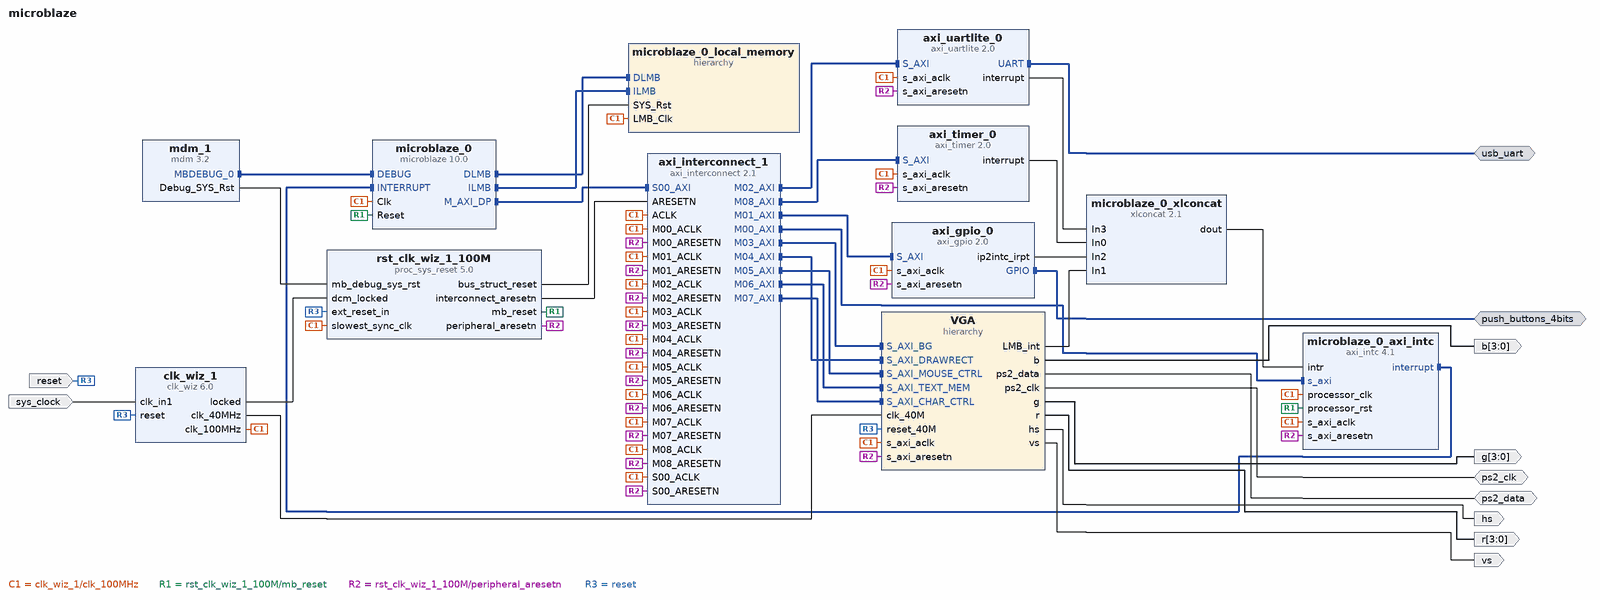
[diagram p0: block diagram of the top level]
# Vivado block design microblaze, xc7a35tcpg236-1, Vivado 2018.2
create_bd_design microblaze

create_bd_intf_port -mode Master -vlnv xilinx.com:interface:uart_rtl:1.0 usb_uart
create_bd_intf_port -mode Master -vlnv xilinx.com:interface:gpio_rtl:1.0 push_buttons_4bits
create_bd_port -dir I -type rst reset
set_property -dict {CONFIG.POLARITY ACTIVE_HIGH} [get_bd_ports reset]
create_bd_port -dir I -type clk sys_clock
set_property -dict {CONFIG.FREQ_HZ 100000000 CONFIG.PHASE 0.000} [get_bd_ports sys_clock]
create_bd_port -dir IO ps2_data
create_bd_port -dir IO ps2_clk
create_bd_port -dir O -from 3 -to 0 b
create_bd_port -dir O -from 3 -to 0 g
create_bd_port -dir O -from 3 -to 0 r
create_bd_port -dir O hs
create_bd_port -dir O vs

create_bd_cell -type ip -vlnv xilinx.com:ip:mdm:3.2 mdm_1
create_bd_cell -type ip -vlnv xilinx.com:ip:clk_wiz:6.0 clk_wiz_1
set_property -dict [list \
  CONFIG.ENABLE_CLOCK_MONITOR false \
  CONFIG.PRIMITIVE MMCM \
  CONFIG.CLKOUT2_USED true \
  CONFIG.NUM_OUT_CLKS 2 \
  CONFIG.CLK_OUT1_PORT clk_100MHz \
  CONFIG.CLK_OUT2_PORT clk_40MHz \
  CONFIG.CLKOUT2_REQUESTED_OUT_FREQ 40.000 \
  CONFIG.PRIM_SOURCE Single_ended_clock_capable_pin \
  CONFIG.MMCM_DIVCLK_DIVIDE 1 \
  CONFIG.MMCM_CLKOUT1_DIVIDE 25 \
  CONFIG.USE_BOARD_FLOW true \
  CONFIG.CLK_IN1_BOARD_INTERFACE sys_clock \
  CONFIG.RESET_BOARD_INTERFACE reset \
  CONFIG.CLKOUT2_JITTER 159.371 \
  CONFIG.CLKOUT2_PHASE_ERROR 98.575 \
] [get_bd_cells clk_wiz_1]
create_bd_cell -type ip -vlnv xilinx.com:ip:proc_sys_reset:5.0 rst_clk_wiz_1_100M
set_property -dict {CONFIG.USE_BOARD_FLOW true CONFIG.RESET_BOARD_INTERFACE reset} [get_bd_cells rst_clk_wiz_1_100M]
create_bd_cell -type ip -vlnv xilinx.com:ip:axi_uartlite:2.0 axi_uartlite_0
set_property -dict {CONFIG.USE_BOARD_FLOW true CONFIG.UARTLITE_BOARD_INTERFACE usb_uart} [get_bd_cells axi_uartlite_0]
create_bd_cell -type ip -vlnv xilinx.com:ip:xlconcat:2.1 microblaze_0_xlconcat
set_property -dict {CONFIG.NUM_PORTS 4} [get_bd_cells microblaze_0_xlconcat]
create_bd_cell -type ip -vlnv xilinx.com:ip:axi_intc:4.1 microblaze_0_axi_intc
set_property -dict {CONFIG.C_HAS_FAST 1} [get_bd_cells microblaze_0_axi_intc]
create_bd_cell -type ip -vlnv xilinx.com:ip:axi_timer:2.0 axi_timer_0
set_property -dict {CONFIG.mode_64bit 0 CONFIG.enable_timer2 0} [get_bd_cells axi_timer_0]
create_bd_cell -type ip -vlnv xilinx.com:ip:axi_gpio:2.0 axi_gpio_0
set_property -dict [list \
  CONFIG.C_INTERRUPT_PRESENT 1 \
  CONFIG.USE_BOARD_FLOW true \
  CONFIG.GPIO_BOARD_INTERFACE push_buttons_4bits \
] [get_bd_cells axi_gpio_0]
create_bd_cell -type hier VGA
create_bd_cell -type ip -vlnv xilinx.com:ip:axi_interconnect:2.1 axi_interconnect_1
set_property -dict {CONFIG.NUM_MI 9} [get_bd_cells axi_interconnect_1]
create_bd_cell -type ip -vlnv xilinx.com:ip:microblaze:10.0 microblaze_0
set_property -dict {CONFIG.C_D_AXI 1 CONFIG.C_D_LMB 1 CONFIG.C_I_LMB 1 CONFIG.C_DEBUG_ENABLED 1} [get_bd_cells microblaze_0]
create_bd_cell -type hier microblaze_0_local_memory

# ---- hierarchy /VGA ----
current_bd_instance /VGA
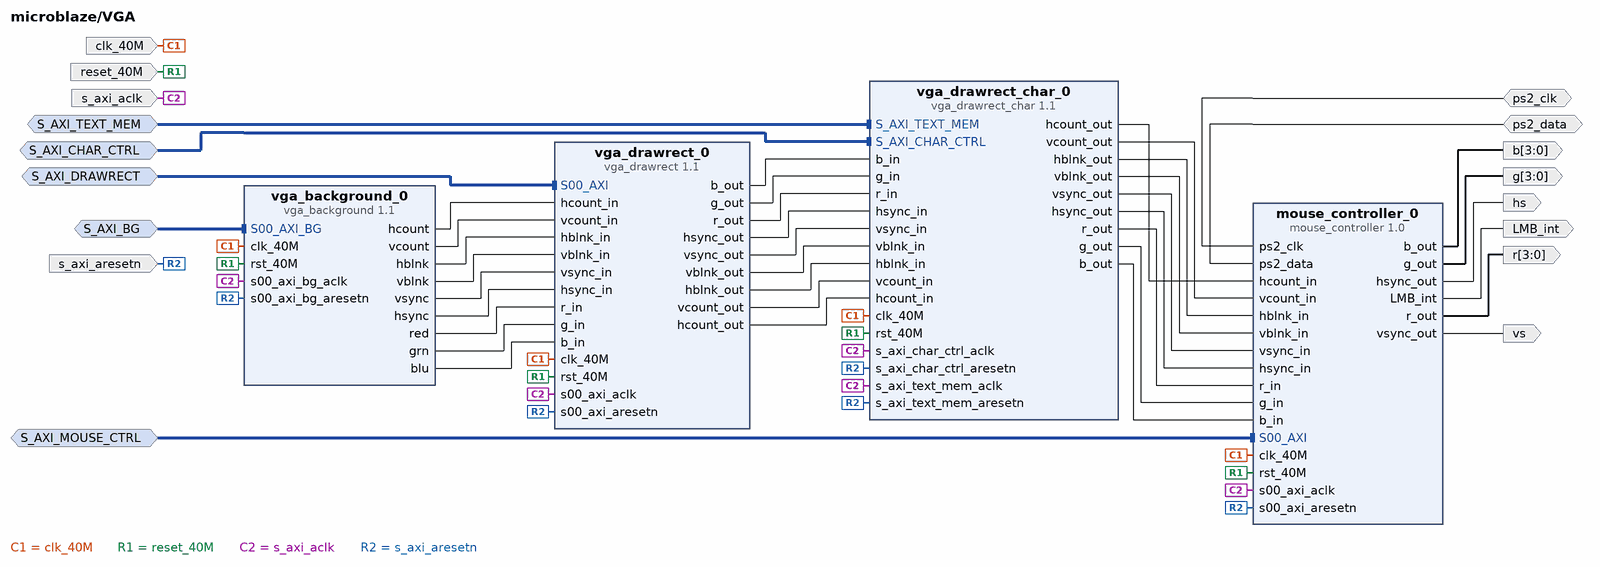
[diagram p1: block diagram inside /VGA]
create_bd_intf_pin -mode Slave -vlnv xilinx.com:interface:aximm_rtl:1.0 S_AXI_BG
create_bd_intf_pin -mode Slave -vlnv xilinx.com:interface:aximm_rtl:1.0 S_AXI_DRAWRECT
create_bd_intf_pin -mode Slave -vlnv xilinx.com:interface:aximm_rtl:1.0 S_AXI_MOUSE_CTRL
create_bd_intf_pin -mode Slave -vlnv xilinx.com:interface:aximm_rtl:1.0 S_AXI_TEXT_MEM
create_bd_intf_pin -mode Slave -vlnv xilinx.com:interface:aximm_rtl:1.0 S_AXI_CHAR_CTRL
create_bd_pin -dir I clk_40M
create_bd_pin -dir I reset_40M
create_bd_pin -dir I -type clk s_axi_aclk
create_bd_pin -dir I -type rst s_axi_aresetn
create_bd_pin -dir O vs
create_bd_pin -dir O hs
create_bd_pin -dir O -from 3 -to 0 r
create_bd_pin -dir O -from 3 -to 0 g
create_bd_pin -dir O -from 3 -to 0 b
create_bd_pin -dir IO ps2_clk
create_bd_pin -dir IO ps2_data
create_bd_pin -dir O LMB_int

create_bd_cell -type ip -vlnv xilinx.com:user:mouse_controller:1.0 mouse_controller_0
create_bd_cell -type ip -vlnv xilinx.com:user:vga_background:1.1 vga_background_0
create_bd_cell -type ip -vlnv xilinx.com:user:vga_drawrect_char:1.1 vga_drawrect_char_0
create_bd_cell -type ip -vlnv xilinx.com:user:vga_drawrect:1.1 vga_drawrect_0
set_property -dict {CONFIG.C_S00_AXI_ADDR_WIDTH 9 CONFIG.NUMBER_OF_RECTANGLES 64} [get_bd_cells vga_drawrect_0]

# ---- hierarchy /microblaze_0_local_memory ----
current_bd_instance /microblaze_0_local_memory
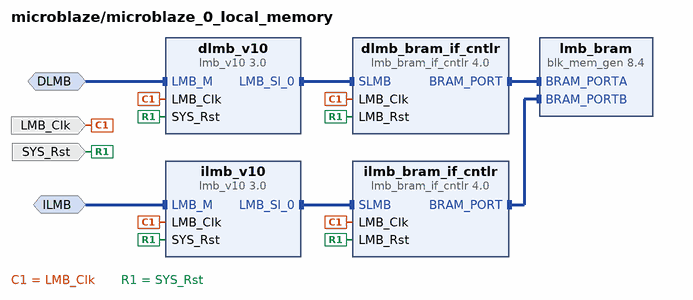
[diagram p2: block diagram inside /microblaze_0_local_memory]
create_bd_intf_pin -mode MirroredMaster -vlnv xilinx.com:interface:lmb_rtl:1.0 DLMB
create_bd_intf_pin -mode MirroredMaster -vlnv xilinx.com:interface:lmb_rtl:1.0 ILMB
create_bd_pin -dir I -type clk LMB_Clk
create_bd_pin -dir I -type rst SYS_Rst

create_bd_cell -type ip -vlnv xilinx.com:ip:lmb_v10:3.0 dlmb_v10
create_bd_cell -type ip -vlnv xilinx.com:ip:lmb_v10:3.0 ilmb_v10
create_bd_cell -type ip -vlnv xilinx.com:ip:lmb_bram_if_cntlr:4.0 dlmb_bram_if_cntlr
set_property -dict {CONFIG.C_ECC 0} [get_bd_cells dlmb_bram_if_cntlr]
create_bd_cell -type ip -vlnv xilinx.com:ip:lmb_bram_if_cntlr:4.0 ilmb_bram_if_cntlr
set_property -dict {CONFIG.C_ECC 0} [get_bd_cells ilmb_bram_if_cntlr]
create_bd_cell -type ip -vlnv xilinx.com:ip:blk_mem_gen:8.4 lmb_bram
set_property -dict {CONFIG.Memory_Type True_Dual_Port_RAM CONFIG.use_bram_block BRAM_Controller} [get_bd_cells lmb_bram]

# ---- connections ----

current_bd_instance /VGA
connect_bd_intf_net [get_bd_intf_pins S_AXI_BG] [get_bd_intf_pins vga_background_0/S00_AXI_BG]
connect_bd_intf_net [get_bd_intf_pins S_AXI_DRAWRECT] [get_bd_intf_pins vga_drawrect_0/S00_AXI]
connect_bd_intf_net [get_bd_intf_pins S_AXI_MOUSE_CTRL] [get_bd_intf_pins mouse_controller_0/S00_AXI]
connect_bd_intf_net [get_bd_intf_pins S_AXI_TEXT_MEM] [get_bd_intf_pins vga_drawrect_char_0/S_AXI_TEXT_MEM]
connect_bd_intf_net [get_bd_intf_pins S_AXI_CHAR_CTRL] [get_bd_intf_pins vga_drawrect_char_0/S_AXI_CHAR_CTRL]
connect_bd_net -net clk_wiz_1_clk_40MHz [get_bd_pins clk_40M] \
  [get_bd_pins mouse_controller_0/clk_40M] [get_bd_pins vga_background_0/clk_40M] [get_bd_pins vga_drawrect_char_0/clk_40M] \
  [get_bd_pins vga_drawrect_0/clk_40M]
connect_bd_net -net reset_1 [get_bd_pins reset_40M] \
  [get_bd_pins mouse_controller_0/rst_40M] [get_bd_pins vga_background_0/rst_40M] [get_bd_pins vga_drawrect_char_0/rst_40M] \
  [get_bd_pins vga_drawrect_0/rst_40M]
connect_bd_net -net microblaze_0_Clk [get_bd_pins s_axi_aclk] \
  [get_bd_pins mouse_controller_0/s00_axi_aclk] [get_bd_pins vga_background_0/s00_axi_bg_aclk] \
  [get_bd_pins vga_drawrect_char_0/s_axi_text_mem_aclk] [get_bd_pins vga_drawrect_char_0/s_axi_char_ctrl_aclk] \
  [get_bd_pins vga_drawrect_0/s00_axi_aclk]
connect_bd_net -net rst_clk_wiz_1_100M_peripheral_aresetn [get_bd_pins s_axi_aresetn] \
  [get_bd_pins mouse_controller_0/s00_axi_aresetn] [get_bd_pins vga_background_0/s00_axi_bg_aresetn] \
  [get_bd_pins vga_drawrect_char_0/s_axi_text_mem_aresetn] [get_bd_pins vga_drawrect_char_0/s_axi_char_ctrl_aresetn] \
  [get_bd_pins vga_drawrect_0/s00_axi_aresetn]
connect_bd_net [get_bd_pins ps2_clk] [get_bd_pins mouse_controller_0/ps2_clk]
connect_bd_net [get_bd_pins ps2_data] [get_bd_pins mouse_controller_0/ps2_data]
connect_bd_net [get_bd_pins mouse_controller_0/LMB_int] [get_bd_pins LMB_int]
connect_bd_net [get_bd_pins vga_drawrect_char_0/hcount_out] [get_bd_pins mouse_controller_0/hcount_in]
connect_bd_net [get_bd_pins vga_drawrect_char_0/vcount_out] [get_bd_pins mouse_controller_0/vcount_in]
connect_bd_net [get_bd_pins vga_drawrect_char_0/hblnk_out] [get_bd_pins mouse_controller_0/hblnk_in]
connect_bd_net [get_bd_pins vga_drawrect_char_0/vblnk_out] [get_bd_pins mouse_controller_0/vblnk_in]
connect_bd_net [get_bd_pins vga_drawrect_char_0/vsync_out] [get_bd_pins mouse_controller_0/vsync_in]
connect_bd_net [get_bd_pins vga_drawrect_char_0/hsync_out] [get_bd_pins mouse_controller_0/hsync_in]
connect_bd_net [get_bd_pins vga_drawrect_char_0/r_out] [get_bd_pins mouse_controller_0/r_in]
connect_bd_net [get_bd_pins vga_drawrect_char_0/g_out] [get_bd_pins mouse_controller_0/g_in]
connect_bd_net [get_bd_pins vga_drawrect_char_0/b_out] [get_bd_pins mouse_controller_0/b_in]
connect_bd_net [get_bd_pins mouse_controller_0/vsync_out] [get_bd_pins vs]
connect_bd_net [get_bd_pins mouse_controller_0/hsync_out] [get_bd_pins hs]
connect_bd_net [get_bd_pins mouse_controller_0/r_out] [get_bd_pins r]
connect_bd_net [get_bd_pins mouse_controller_0/g_out] [get_bd_pins g]
connect_bd_net [get_bd_pins mouse_controller_0/b_out] [get_bd_pins b]
connect_bd_net [get_bd_pins vga_background_0/hcount] [get_bd_pins vga_drawrect_0/hcount_in]
connect_bd_net [get_bd_pins vga_background_0/vcount] [get_bd_pins vga_drawrect_0/vcount_in]
connect_bd_net [get_bd_pins vga_background_0/hblnk] [get_bd_pins vga_drawrect_0/hblnk_in]
connect_bd_net [get_bd_pins vga_background_0/vblnk] [get_bd_pins vga_drawrect_0/vblnk_in]
connect_bd_net [get_bd_pins vga_background_0/vsync] [get_bd_pins vga_drawrect_0/vsync_in]
connect_bd_net [get_bd_pins vga_background_0/hsync] [get_bd_pins vga_drawrect_0/hsync_in]
connect_bd_net [get_bd_pins vga_background_0/red] [get_bd_pins vga_drawrect_0/r_in]
connect_bd_net [get_bd_pins vga_background_0/grn] [get_bd_pins vga_drawrect_0/g_in]
connect_bd_net [get_bd_pins vga_background_0/blu] [get_bd_pins vga_drawrect_0/b_in]
connect_bd_net [get_bd_pins vga_drawrect_0/b_out] [get_bd_pins vga_drawrect_char_0/b_in]
connect_bd_net [get_bd_pins vga_drawrect_0/g_out] [get_bd_pins vga_drawrect_char_0/g_in]
connect_bd_net [get_bd_pins vga_drawrect_0/r_out] [get_bd_pins vga_drawrect_char_0/r_in]
connect_bd_net [get_bd_pins vga_drawrect_0/hsync_out] [get_bd_pins vga_drawrect_char_0/hsync_in]
connect_bd_net [get_bd_pins vga_drawrect_0/vsync_out] [get_bd_pins vga_drawrect_char_0/vsync_in]
connect_bd_net [get_bd_pins vga_drawrect_0/vblnk_out] [get_bd_pins vga_drawrect_char_0/vblnk_in]
connect_bd_net [get_bd_pins vga_drawrect_0/hblnk_out] [get_bd_pins vga_drawrect_char_0/hblnk_in]
connect_bd_net [get_bd_pins vga_drawrect_0/vcount_out] [get_bd_pins vga_drawrect_char_0/vcount_in]
connect_bd_net [get_bd_pins vga_drawrect_0/hcount_out] [get_bd_pins vga_drawrect_char_0/hcount_in]

current_bd_instance /microblaze_0_local_memory
connect_bd_intf_net -intf_net microblaze_0_dlmb_bus [get_bd_intf_pins dlmb_v10/LMB_Sl_0] [get_bd_intf_pins dlmb_bram_if_cntlr/SLMB]
connect_bd_intf_net -intf_net microblaze_0_ilmb_bus [get_bd_intf_pins ilmb_v10/LMB_Sl_0] [get_bd_intf_pins ilmb_bram_if_cntlr/SLMB]
connect_bd_intf_net -intf_net microblaze_0_dlmb_cntlr [get_bd_intf_pins dlmb_bram_if_cntlr/BRAM_PORT] [get_bd_intf_pins lmb_bram/BRAM_PORTA]
connect_bd_intf_net -intf_net microblaze_0_ilmb_cntlr [get_bd_intf_pins ilmb_bram_if_cntlr/BRAM_PORT] [get_bd_intf_pins lmb_bram/BRAM_PORTB]
connect_bd_intf_net -intf_net microblaze_0_dlmb [get_bd_intf_pins DLMB] [get_bd_intf_pins dlmb_v10/LMB_M]
connect_bd_intf_net -intf_net microblaze_0_ilmb [get_bd_intf_pins ILMB] [get_bd_intf_pins ilmb_v10/LMB_M]
connect_bd_net -net microblaze_0_Clk [get_bd_pins LMB_Clk] \
  [get_bd_pins dlmb_v10/LMB_Clk] [get_bd_pins dlmb_bram_if_cntlr/LMB_Clk] [get_bd_pins ilmb_v10/LMB_Clk] \
  [get_bd_pins ilmb_bram_if_cntlr/LMB_Clk]
connect_bd_net [get_bd_pins SYS_Rst] \
  [get_bd_pins dlmb_v10/SYS_Rst] [get_bd_pins dlmb_bram_if_cntlr/LMB_Rst] [get_bd_pins ilmb_v10/SYS_Rst] \
  [get_bd_pins ilmb_bram_if_cntlr/LMB_Rst]

current_bd_instance /
connect_bd_intf_net [get_bd_intf_pins microblaze_0/DLMB] [get_bd_intf_pins microblaze_0_local_memory/DLMB]
connect_bd_intf_net [get_bd_intf_pins microblaze_0/ILMB] [get_bd_intf_pins microblaze_0_local_memory/ILMB]
connect_bd_intf_net [get_bd_intf_pins microblaze_0_axi_intc/interrupt] [get_bd_intf_pins microblaze_0/INTERRUPT]
connect_bd_intf_net [get_bd_intf_pins mdm_1/MBDEBUG_0] [get_bd_intf_pins microblaze_0/DEBUG]
connect_bd_intf_net [get_bd_intf_pins microblaze_0/M_AXI_DP] [get_bd_intf_pins axi_interconnect_1/S00_AXI]
connect_bd_intf_net [get_bd_intf_pins axi_interconnect_1/M00_AXI] [get_bd_intf_pins microblaze_0_axi_intc/s_axi]
connect_bd_intf_net [get_bd_intf_pins axi_interconnect_1/M01_AXI] [get_bd_intf_pins axi_gpio_0/S_AXI]
connect_bd_intf_net [get_bd_intf_pins axi_interconnect_1/M02_AXI] [get_bd_intf_pins axi_uartlite_0/S_AXI]
connect_bd_intf_net [get_bd_intf_pins axi_interconnect_1/M03_AXI] [get_bd_intf_pins VGA/S_AXI_BG]
connect_bd_intf_net [get_bd_intf_pins axi_interconnect_1/M04_AXI] [get_bd_intf_pins VGA/S_AXI_DRAWRECT]
connect_bd_intf_net [get_bd_intf_pins axi_interconnect_1/M05_AXI] [get_bd_intf_pins VGA/S_AXI_MOUSE_CTRL]
connect_bd_intf_net [get_bd_intf_pins axi_interconnect_1/M06_AXI] [get_bd_intf_pins VGA/S_AXI_TEXT_MEM]
connect_bd_intf_net [get_bd_intf_pins axi_interconnect_1/M07_AXI] [get_bd_intf_pins VGA/S_AXI_CHAR_CTRL]
connect_bd_intf_net [get_bd_intf_pins axi_interconnect_1/M08_AXI] [get_bd_intf_pins axi_timer_0/S_AXI]
connect_bd_intf_net [get_bd_intf_ports usb_uart] [get_bd_intf_pins axi_uartlite_0/UART]
connect_bd_intf_net [get_bd_intf_ports push_buttons_4bits] [get_bd_intf_pins axi_gpio_0/GPIO]
connect_bd_net -net microblaze_0_Clk [get_bd_pins clk_wiz_1/clk_100MHz] \
  [get_bd_pins rst_clk_wiz_1_100M/slowest_sync_clk] [get_bd_pins axi_uartlite_0/s_axi_aclk] \
  [get_bd_pins axi_timer_0/s_axi_aclk] [get_bd_pins axi_gpio_0/s_axi_aclk] [get_bd_pins microblaze_0/Clk] \
  [get_bd_pins microblaze_0_axi_intc/s_axi_aclk] [get_bd_pins microblaze_0_axi_intc/processor_clk] \
  [get_bd_pins VGA/s_axi_aclk] [get_bd_pins axi_interconnect_1/ACLK] [get_bd_pins axi_interconnect_1/S00_ACLK] \
  [get_bd_pins axi_interconnect_1/M00_ACLK] [get_bd_pins axi_interconnect_1/M01_ACLK] \
  [get_bd_pins axi_interconnect_1/M02_ACLK] [get_bd_pins axi_interconnect_1/M03_ACLK] \
  [get_bd_pins axi_interconnect_1/M04_ACLK] [get_bd_pins axi_interconnect_1/M05_ACLK] \
  [get_bd_pins axi_interconnect_1/M06_ACLK] [get_bd_pins axi_interconnect_1/M07_ACLK] \
  [get_bd_pins axi_interconnect_1/M08_ACLK] [get_bd_pins microblaze_0_local_memory/LMB_Clk]
connect_bd_net [get_bd_pins clk_wiz_1/locked] [get_bd_pins rst_clk_wiz_1_100M/dcm_locked]
connect_bd_net [get_bd_pins rst_clk_wiz_1_100M/mb_reset] [get_bd_pins microblaze_0_axi_intc/processor_rst] [get_bd_pins microblaze_0/Reset]
connect_bd_net [get_bd_pins rst_clk_wiz_1_100M/peripheral_aresetn] \
  [get_bd_pins axi_uartlite_0/s_axi_aresetn] [get_bd_pins microblaze_0_axi_intc/s_axi_aresetn] \
  [get_bd_pins axi_timer_0/s_axi_aresetn] [get_bd_pins axi_gpio_0/s_axi_aresetn] [get_bd_pins VGA/s_axi_aresetn] \
  [get_bd_pins axi_interconnect_1/S00_ARESETN] [get_bd_pins axi_interconnect_1/M00_ARESETN] \
  [get_bd_pins axi_interconnect_1/M01_ARESETN] [get_bd_pins axi_interconnect_1/M02_ARESETN] \
  [get_bd_pins axi_interconnect_1/M03_ARESETN] [get_bd_pins axi_interconnect_1/M04_ARESETN] \
  [get_bd_pins axi_interconnect_1/M05_ARESETN] [get_bd_pins axi_interconnect_1/M06_ARESETN] \
  [get_bd_pins axi_interconnect_1/M07_ARESETN] [get_bd_pins axi_interconnect_1/M08_ARESETN]
connect_bd_net [get_bd_pins mdm_1/Debug_SYS_Rst] [get_bd_pins rst_clk_wiz_1_100M/mb_debug_sys_rst]
connect_bd_net [get_bd_ports reset] [get_bd_pins clk_wiz_1/reset] [get_bd_pins rst_clk_wiz_1_100M/ext_reset_in] [get_bd_pins VGA/reset_40M]
connect_bd_net [get_bd_ports sys_clock] [get_bd_pins clk_wiz_1/clk_in1]
connect_bd_net [get_bd_pins clk_wiz_1/clk_40MHz] [get_bd_pins VGA/clk_40M]
connect_bd_net -net microblaze_0_intr [get_bd_pins microblaze_0_xlconcat/dout] [get_bd_pins microblaze_0_axi_intc/intr]
connect_bd_net [get_bd_pins axi_timer_0/interrupt] [get_bd_pins microblaze_0_xlconcat/In0]
connect_bd_net -net mouse_controller_0_LMB_int [get_bd_pins VGA/LMB_int] [get_bd_pins microblaze_0_xlconcat/In1]
connect_bd_net [get_bd_ports ps2_data] [get_bd_pins VGA/ps2_data]
connect_bd_net [get_bd_ports ps2_clk] [get_bd_pins VGA/ps2_clk]
connect_bd_net -net mouse_controller_0_b_out [get_bd_pins VGA/b] [get_bd_ports b]
connect_bd_net -net mouse_controller_0_g_out [get_bd_pins VGA/g] [get_bd_ports g]
connect_bd_net -net mouse_controller_0_r_out [get_bd_pins VGA/r] [get_bd_ports r]
connect_bd_net -net mouse_controller_0_hsync_out [get_bd_pins VGA/hs] [get_bd_ports hs]
connect_bd_net -net mouse_controller_0_vsync_out [get_bd_pins VGA/vs] [get_bd_ports vs]
connect_bd_net [get_bd_pins rst_clk_wiz_1_100M/interconnect_aresetn] [get_bd_pins axi_interconnect_1/ARESETN]
connect_bd_net [get_bd_pins axi_gpio_0/ip2intc_irpt] [get_bd_pins microblaze_0_xlconcat/In2]
connect_bd_net [get_bd_pins axi_uartlite_0/interrupt] [get_bd_pins microblaze_0_xlconcat/In3]
connect_bd_net [get_bd_pins rst_clk_wiz_1_100M/bus_struct_reset] [get_bd_pins microblaze_0_local_memory/SYS_Rst]

# ---- address map ----
assign_bd_address -offset 0x00000000 -range 64K -target_address_space [get_bd_addr_spaces microblaze_0/Data] [get_bd_addr_segs microblaze_0_local_memory/dlmb_bram_if_cntlr/SLMB/Mem]
assign_bd_address -offset 0x40000000 -range 4K -target_address_space [get_bd_addr_spaces microblaze_0/Data] [get_bd_addr_segs axi_gpio_0/S_AXI/Reg]
assign_bd_address -offset 0x40600000 -range 4K -target_address_space [get_bd_addr_spaces microblaze_0/Data] [get_bd_addr_segs axi_uartlite_0/S_AXI/Reg]
assign_bd_address -offset 0x41200000 -range 4K -target_address_space [get_bd_addr_spaces microblaze_0/Data] [get_bd_addr_segs microblaze_0_axi_intc/S_AXI/Reg]
assign_bd_address -offset 0x41C00000 -range 4K -target_address_space [get_bd_addr_spaces microblaze_0/Data] [get_bd_addr_segs axi_timer_0/S_AXI/Reg]
assign_bd_address -offset 0x44A00000 -range 4K -target_address_space [get_bd_addr_spaces microblaze_0/Data] [get_bd_addr_segs VGA/mouse_controller_0/S00_AXI/S00_AXI_reg]
assign_bd_address -offset 0x44A10000 -range 4K -target_address_space [get_bd_addr_spaces microblaze_0/Data] [get_bd_addr_segs VGA/vga_background_0/S00_AXI_BG/S00_AXI_BG_reg]
assign_bd_address -offset 0x44A20000 -range 4K -target_address_space [get_bd_addr_spaces microblaze_0/Data] [get_bd_addr_segs VGA/vga_drawrect_0/S00_AXI/S00_AXI_reg]
assign_bd_address -offset 0x44A30000 -range 4K -target_address_space [get_bd_addr_spaces microblaze_0/Data] [get_bd_addr_segs VGA/vga_drawrect_char_0/S_AXI_CHAR_CTRL/S_AXI_CHAR_CTRL_reg]
assign_bd_address -offset 0x76000000 -range 4K -target_address_space [get_bd_addr_spaces microblaze_0/Data] [get_bd_addr_segs VGA/vga_drawrect_char_0/S_AXI_TEXT_MEM/S_AXI_TEXT_MEM_mem]
assign_bd_address -offset 0x00000000 -range 64K -target_address_space [get_bd_addr_spaces microblaze_0/Instruction] [get_bd_addr_segs microblaze_0_local_memory/ilmb_bram_if_cntlr/SLMB/Mem]

validate_bd_design
save_bd_design
